# EAGLE schematic 10ACto3.3DC V1 (EAGLE 9.6.2)
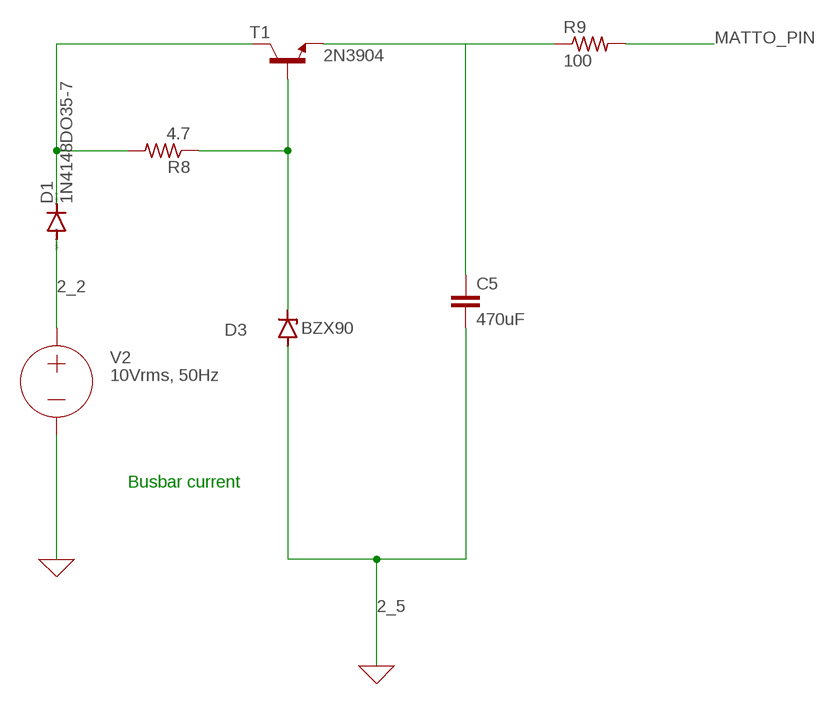
[diagram p0: schematic, sheet 1]

## Parts
C5  470uF  C2,5-3  [C2.5-3]
D1  1N4148DO35-7  [DO35-7]
D3  BZX90  [DO34Z7]
R8  4.7  R-US_0204/7  [0204/7]
R9  100  R-US_0204/7  [0204/7]
T1  2N3904  [TO92]
V2  10Vrms, 50Hz  VOLTAGE  (no package)

## Nets
0: V2.- ; supply symbol labelled GND
2_2: D1.A V2.+
2_5: C5.2 D3.A ; supply symbol labelled GND
BUSBAR_CURRENT: D1.C R8.2 T1.1(C)
MATTO_PIN: R9.2
N$8: D3.C R8.1 T1.2(B)
N$10: C5.1 R9.1 T1.3(E)

## Notes on the sheet
- Busbar current

## Library data of the parts
C5 = capacitor-wima:C: CAPACITOR naming: grid - package width
D1 = diode:1N4148: DIODE high speed (Philips)
D3 = diode:BZX90: Z DIODE
R8 R9 = rcl:R-US_: RESISTOR, American symbol; SPICEPREFIX: R
T1 = transistor:2N3904: NPN TRANSISTOR
V2 = ngspice-simulation:VOLTAGE: Independent Voltage Source, either DC, AC, PULSE, SINE, PWL, EXP, or SFFM; VALUE: 0V